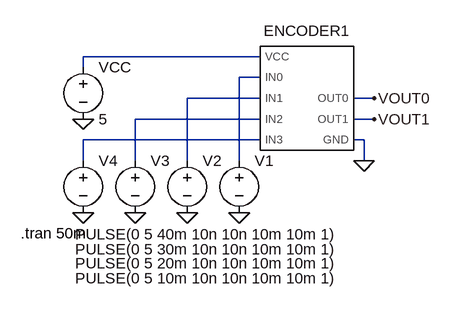
[diagram p0: schematic encoder_test.asc]
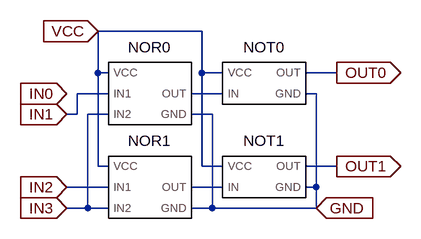
[diagram p1: sub-circuit encoder_4to2.asc]
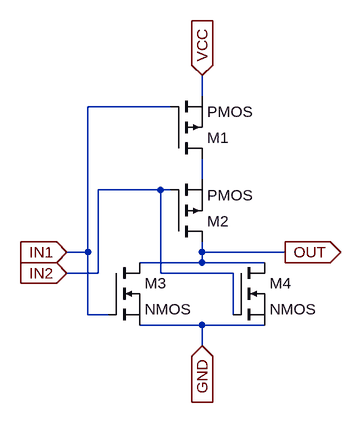
[diagram p2: sub-circuit nor.asc]
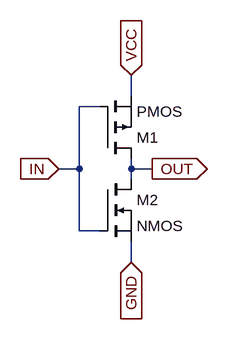
[diagram p3: sub-circuit not.asc]
encoder_test.asc, the LTspice schematic file:
Version 4.1
SHEET 1 880 680
WIRE 96 96 -176 96
WIRE -176 112 -176 96
WIRE 96 128 64 128
WIRE 96 160 -16 160
WIRE 272 160 240 160
WIRE 96 192 -96 192
WIRE 272 192 240 192
WIRE 96 224 -176 224
WIRE 256 224 240 224
WIRE -176 256 -176 224
WIRE -96 256 -96 192
WIRE -16 256 -16 160
WIRE 64 256 64 128
WIRE 256 256 256 224
FLAG -176 336 0
FLAG -96 336 0
FLAG -16 336 0
FLAG 64 336 0
FLAG -176 192 0
FLAG 256 256 0
FLAG 272 160 VOUT0
FLAG 272 192 VOUT1
SYMBOL encoder_4to2 160 176 R0
SYMATTR InstName ENCODER1
SYMBOL voltage 64 240 R0
WINDOW 3 -252 197 Left 2
WINDOW 123 0 0 Left 0
WINDOW 39 0 0 Left 0
SYMATTR InstName V1
SYMATTR Value PULSE(0 5 10m 10n 10n 10m 10m 1)
SYMBOL voltage -16 240 R0
WINDOW 3 -172 174 Left 2
WINDOW 123 0 0 Left 0
WINDOW 39 0 0 Left 0
SYMATTR InstName V2
SYMATTR Value PULSE(0 5 20m 10n 10n 10m 10m 1)
SYMBOL voltage -96 240 R0
WINDOW 3 -92 152 Left 2
WINDOW 123 0 0 Left 0
WINDOW 39 0 0 Left 0
SYMATTR InstName V3
SYMATTR Value PULSE(0 5 30m 10n 10n 10m 10m 1)
SYMBOL voltage -176 240 R0
WINDOW 3 -12 129 Left 2
WINDOW 123 0 0 Left 0
WINDOW 39 0 0 Left 0
SYMATTR InstName V4
SYMATTR Value PULSE(0 5 40m 10n 10n 10m 10m 1)
SYMBOL voltage -176 96 R0
SYMATTR InstName VCC
SYMATTR Value 5
TEXT -272 368 Left 2 !.tran 50m

encoder_4to2.asc, the sub-circuit schematic file:
Version 4.1
SHEET 1 880 680
WIRE 304 32 144 32
WIRE 144 96 144 32
WIRE 160 96 144 96
WIRE 304 96 304 32
WIRE 336 96 304 96
WIRE 512 96 464 96
WIRE 160 128 112 128
WIRE 336 128 288 128
WIRE 480 128 464 128
WIRE 112 160 112 128
WIRE 112 160 96 160
WIRE 160 160 128 160
WIRE 320 160 288 160
WIRE 144 240 144 96
WIRE 160 240 144 240
WIRE 304 240 304 96
WIRE 336 240 304 240
WIRE 512 240 464 240
WIRE 160 272 96 272
WIRE 336 272 288 272
WIRE 480 272 480 128
WIRE 480 272 464 272
WIRE 128 304 128 160
WIRE 128 304 96 304
WIRE 160 304 128 304
WIRE 320 304 320 160
WIRE 320 304 288 304
WIRE 480 304 480 272
WIRE 480 304 320 304
FLAG 144 32 VCC
IOPIN 144 32 In
FLAG 480 304 GND
IOPIN 480 304 In
FLAG 96 128 IN0
IOPIN 96 128 In
FLAG 96 160 IN1
IOPIN 96 160 In
FLAG 96 272 IN2
IOPIN 96 272 In
FLAG 96 304 IN3
IOPIN 96 304 In
FLAG 512 240 OUT1
IOPIN 512 240 Out
FLAG 512 96 OUT0
IOPIN 512 96 Out
SYMBOL nor 224 144 R0
SYMATTR InstName NOR0
SYMBOL nor 224 288 R0
SYMATTR InstName NOR1
SYMBOL not 400 112 R0
SYMATTR InstName NOT0
SYMBOL not 400 256 R0
SYMATTR InstName NOT1

nor.asc, the sub-circuit schematic file:
Version 4.1
SHEET 1 880 680
WIRE 176 -80 176 -112
WIRE 128 -64 0 -64
WIRE 176 48 176 16
WIRE 112 64 16 64
WIRE 128 64 112 64
WIRE 0 160 0 -64
WIRE 0 160 -32 160
WIRE 176 160 176 144
WIRE 304 160 176 160
WIRE 176 176 176 160
WIRE 176 176 80 176
WIRE 272 176 176 176
WIRE 16 192 16 64
WIRE 16 192 -32 192
WIRE 112 192 112 64
WIRE 224 192 112 192
WIRE 0 256 0 160
WIRE 32 256 0 256
WIRE 224 256 224 192
WIRE 176 272 80 272
WIRE 272 272 176 272
WIRE 176 304 176 272
FLAG -32 160 IN1
IOPIN -32 160 In
FLAG 304 160 OUT
IOPIN 304 160 Out
FLAG -32 192 IN2
IOPIN -32 192 In
FLAG 176 -112 VCC
IOPIN 176 -112 In
FLAG 176 304 GND
IOPIN 176 304 In
SYMBOL pmos 128 16 M180
SYMATTR InstName M1
SYMBOL pmos 128 144 M180
SYMATTR InstName M2
SYMBOL nmos 32 176 R0
SYMATTR InstName M3
SYMBOL nmos 224 176 R0
SYMATTR InstName M4

not.asc, the sub-circuit schematic file:
Version 4.1
SHEET 1 880 680
WIRE 176 48 176 16
WIRE 128 64 96 64
WIRE 96 160 96 64
WIRE 96 160 64 160
WIRE 176 160 176 144
WIRE 208 160 176 160
WIRE 176 176 176 160
WIRE 96 256 96 160
WIRE 128 256 96 256
WIRE 176 304 176 272
FLAG 64 160 IN
IOPIN 64 160 In
FLAG 208 160 OUT
IOPIN 208 160 Out
FLAG 176 16 VCC
IOPIN 176 16 In
FLAG 176 304 GND
IOPIN 176 304 In
SYMBOL pmos 128 144 M180
SYMATTR InstName M1
SYMBOL nmos 128 176 R0
SYMATTR InstName M2

The netlist it stands for:
* encoder_test.asc
X§ENCODER1 0 N002 N003 N004 N005 N001 VOUT0 VOUT1 encoder_4to2
V1 N002 0 PULSE(0 5 10m 10n 10n 10m 10m 1)
V2 N003 0 PULSE(0 5 20m 10n 10n 10m 10m 1)
V3 N004 0 PULSE(0 5 30m 10n 10n 10m 10m 1)
V4 N005 0 PULSE(0 5 40m 10n 10n 10m 10m 1)
VCC N001 0 5

* block symbol definitions
.subckt encoder_4to2 GND IN0 IN1 IN2 IN3 VCC OUT0 OUT1
X§NOR0 GND IN1 IN3 VCC N001 nor
X§NOR1 GND IN2 IN3 VCC N002 nor
X§NOT0 GND N001 VCC OUT0 not
X§NOT1 GND N002 VCC OUT1 not
.ends encoder_4to2

.subckt nor GND IN1 IN2 VCC OUT
M1 N001 IN1 VCC VCC PMOS
M2 OUT IN2 N001 N001 PMOS
M3 OUT IN1 GND GND NMOS
M4 OUT IN2 GND GND NMOS
.ends nor

.subckt not GND IN VCC OUT
M1 OUT IN VCC VCC PMOS
M2 OUT IN GND GND NMOS
.ends not

.model NMOS NMOS
.model PMOS PMOS
.lib standard.mos
.tran 50m
.backanno
.end